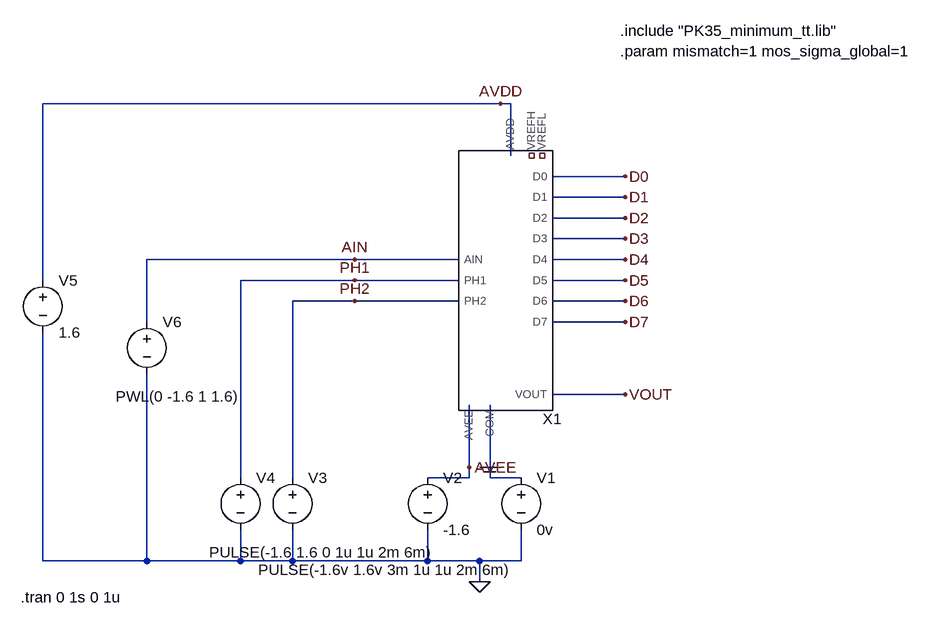
[diagram p0: schematic Draft6.asc]
Draft6.asc, the LTspice schematic file:
Version 4
SHEET 1 880 680
WIRE 160 -144 -544 -144
WIRE 176 -144 160 -144
WIRE 176 -64 176 -144
WIRE 352 -32 240 -32
WIRE 352 0 240 0
WIRE 352 32 240 32
WIRE 352 64 240 64
WIRE -64 96 -384 96
WIRE 96 96 -64 96
WIRE 352 96 240 96
WIRE -544 128 -544 -144
WIRE -64 128 -240 128
WIRE 96 128 -64 128
WIRE 352 128 240 128
WIRE -64 160 -160 160
WIRE 96 160 -64 160
WIRE 352 160 240 160
WIRE -384 192 -384 96
WIRE 352 192 240 192
WIRE 352 304 240 304
WIRE 112 416 112 320
WIRE 144 416 144 320
WIRE -240 432 -240 128
WIRE -160 432 -160 160
WIRE 112 432 112 416
WIRE 112 432 48 432
WIRE 144 432 144 416
WIRE 192 432 144 432
WIRE -544 560 -544 208
WIRE -384 560 -384 272
WIRE -384 560 -544 560
WIRE -240 560 -240 512
WIRE -240 560 -384 560
WIRE -160 560 -160 512
WIRE -160 560 -240 560
WIRE 48 560 48 512
WIRE 48 560 -160 560
WIRE 128 560 48 560
WIRE 192 560 192 512
WIRE 192 560 128 560
WIRE 128 592 128 560
FLAG 128 592 0
FLAG 352 -32 D0
FLAG 352 0 D1
FLAG 352 32 D2
FLAG 352 64 D3
FLAG 352 96 D4
FLAG 352 128 D5
FLAG 352 160 D6
FLAG 352 192 D7
FLAG 352 304 VOUT
FLAG 144 416 COM
FLAG 112 416 AVEE
FLAG 160 -144 AVDD
FLAG -64 160 PH2
FLAG -64 128 PH1
FLAG -64 96 AIN
SYMBOL pipe_line_adc_8bit 160 128 R0
SYMATTR InstName X1
SYMBOL voltage 192 416 R0
WINDOW 123 0 0 Left 0
WINDOW 39 0 0 Left 0
SYMATTR InstName V1
SYMATTR Value 0v
SYMBOL voltage 48 416 R0
WINDOW 123 0 0 Left 0
WINDOW 39 0 0 Left 0
SYMATTR InstName V2
SYMATTR Value -1.6
SYMBOL voltage -160 416 R0
WINDOW 3 -53 158 Left 2
WINDOW 123 0 0 Left 0
WINDOW 39 0 0 Left 0
SYMATTR InstName V3
SYMATTR Value PULSE(-1.6v 1.6v 3m 1u 1u 2m 6m)
SYMBOL voltage -240 416 R0
WINDOW 3 -48 131 Left 2
WINDOW 123 0 0 Left 0
WINDOW 39 0 0 Left 0
SYMATTR InstName V4
SYMATTR Value PULSE(-1.6 1.6 0 1u 1u 2m 6m)
SYMBOL voltage -544 112 R0
WINDOW 123 0 0 Left 0
WINDOW 39 0 0 Left 0
SYMATTR InstName V5
SYMATTR Value 1.6
SYMBOL voltage -384 176 R0
WINDOW 3 -48 131 Left 2
WINDOW 123 0 0 Left 0
WINDOW 39 0 0 Left 0
SYMATTR InstName V6
SYMATTR Value PWL(0 -1.6 1 1.6)
TEXT 344 -256 Left 2 !.include "PK35_minimum_tt.lib"\n.param mismatch=1 mos_sigma_global=1
TEXT -578 616 Left 2 !.tran 0 1s 0 1u

The netlist it stands for:
* Draft6.asc
XX1 AIN PH1 PH2 AVDD AVEE COM D0 D1 D2 D3 D4 D5 D6 D7 VOUT NC_01 NC_02 pipe_line_adc_8bit  ; pins AIN PH1 PH2 AVDD AVEE COM D0 D1 D2 D3 D4 D5 D6 D7 VOUT VREFH VREFL
V1 COM 0 0v
V2 AVEE 0 -1.6
V3 PH2 0 PULSE(-1.6v 1.6v 3m 1u 1u 2m 6m)
V4 PH1 0 PULSE(-1.6 1.6 0 1u 1u 2m 6m)
V5 AVDD 0 1.6
V6 AIN 0 PWL(0 -1.6 1 1.6)
.include "PK35_minimum_tt.lib"
.param mismatch=1 mos_sigma_global=1
.tran 0 1s 0 1u
.backanno
.end